# Altium schematic sheet B502DA.SchDoc: Air Temperature and Humidity Sensor
size A4; SheetNumber: 1; SheetTotal: 1
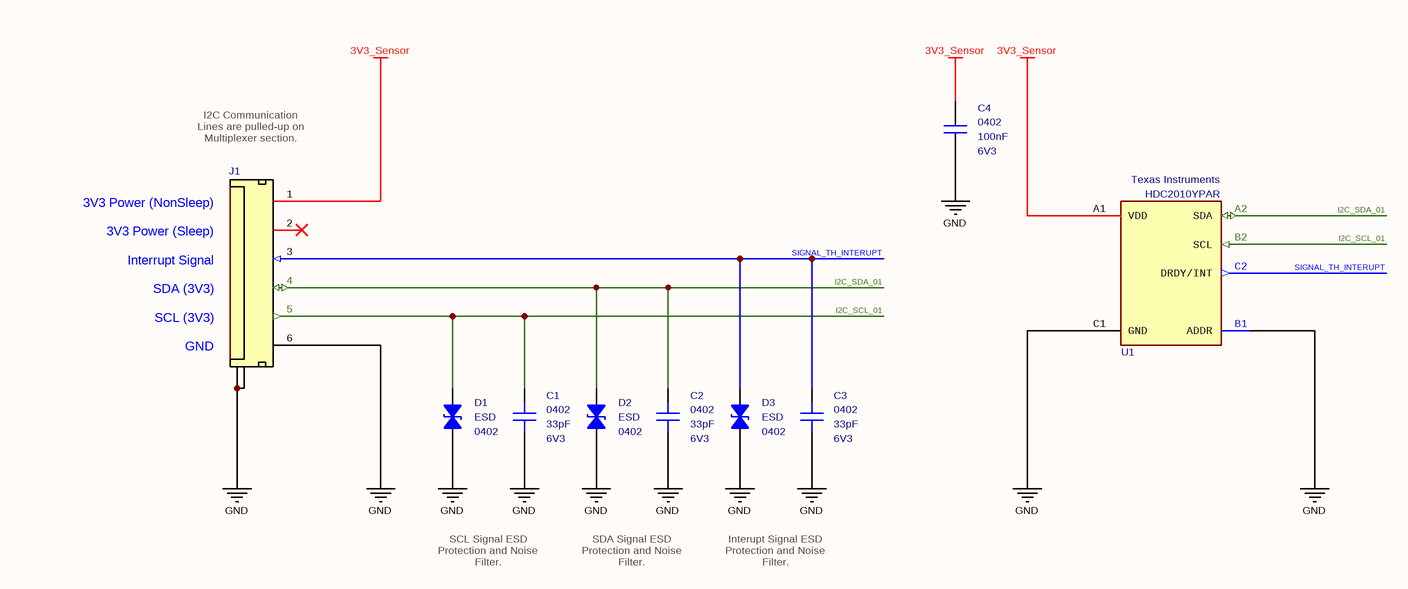
[diagram p0: B502DA.SchDoc]

## Parts
C1  value 33pF  Case: 0402  Voltage: 6V3  [CAPACITOR_0402]  (hidden comment: Multilayer Ceramic Capacitor)
C2  value 33pF  Case: 0402  Voltage: 6V3  [CAPACITOR_0402]  (hidden comment: Multilayer Ceramic Capacitor)
C3  value 33pF  Case: 0402  Voltage: 6V3  [CAPACITOR_0402]  (hidden comment: Multilayer Ceramic Capacitor)
C4  value 100nF  Case: 0402  Voltage: 6V3  [CAPACITOR_0402]  (hidden comment: Multilayer Ceramic Capacitor)
D1  Case: 0402  [ESD_0402]  (hidden comment: ESD Suppressors)
D2  Case: 0402  [ESD_0402]  (hidden comment: ESD Suppressors)
D3  Case: 0402  [ESD_0402]  (hidden comment: ESD Suppressors)
J1  T/H Sensor Socket  [Connector_Tunic 6P - H]  (value not drawn)
U1  Manufacturer_Part_Number: HDC2010YPAR  Manufacturer_Name: Texas Instruments  [HDC2010]  (hidden comment: Humidity and temperature digital sensor)

## Nets
3V3_Sensor: C4.1 J1.1(3V3_Sensor) U1.A1(VDD)
GND: C1.1 C2.1 C3.1 C4.2 D1.1 D2.1 D3.1 J1.6(GND) J1.7(Termination) J1.8(Termination) U1.B1(ADDR) U1.C1(GND)
I2C_SCL_01: C1.2 D1.2 J1.5(I2C_SCL_01) U1.B2(SCL)
I2C_SDA_01: C2.2 D2.2 J1.4(I2C_SDA_01) U1.A2(SDA)
SIGNAL_TH_INTERUPT: C3.2 D3.2 J1.3(SIGNAL_TH_INTERUPT) U1.C2(DRDY/INT)

Not connected (* = marked no-connect by the designer): J1 2(3V3_Digital)*

## Notes on the sheet
- I2C Communication Lines are pulled-up on Multiplexer section.
- (near J1) 3V3 Power (NonSleep)
  3V3 Power (Sleep)
  Interrupt Signal
  SDA (3V3)
  SCL (3V3)
  GND
- SCL Signal ESD Protection and Noise Filter.
- SDA Signal ESD Protection and Noise Filter.
- Interupt Signal ESD Protection and Noise Filter.
- Title
- Size:
- Date:
- A4
- Number:
- Time:
- Revision:
- Sheet
- of
- File:
- (in symbol Diode - ESD Protection) ESD

## Library data of the parts
C1-C3 = Capacitor - 33pF [0402-6V3]: Capacitor - 33pF [0402] (Ceramic); Manufacturer_Name: Kemet; Manufacturer_Part_Number: C0402C330J9RACAUTO; Dielectric: X7R; Tolerance: 10%; Height: 0.5mm; Mouser_Part_Number: 80-C0402C330J9RAUTO; Maximum Operating Temperature: +125; Minimum Operating Temperature: -55; ROHS: Yes; ComponentLink1Description: DataSheet; ComponentLink1URL: https://api.kemet.com/component-edge/download/datasheet/C0402C330J9RACAUTO.pdf; ComponentLink2Description: Mouser; ComponentLink2URL: https://www.mouser.com/Search/Refine.aspx?Keyword=80-C0402C330J9RAUTO; Supplier 1: Mouser; Supplier Part Number 1: 80-C0402C330J9RAUTO
C4 = Capacitor - 100nF [0402-6V3]: Capacitor - 100nF [0402-6V3] (Ceramic); Manufacturer_Name: AVX; Manufacturer_Part_Number: 04026D104KAT4A; Dielectric: X5R; Tolerance: %10; Height: 0.25mm; Mouser_Part_Number: 581-04026D104KAT4A; ComponentLink1Description: Mouser; ComponentLink1URL: https://www.mouser.com.tr/ProductDetail/AVX/04026D104KAT4A?qs=sGAEpiMZZMs0AnBnWHyRQPg4iYkCw7IMED%2F4kpqgf7w%3D; ComponentLink2Description: DataSheet; ComponentLink2URL: https://www.mouser.com.tr/datasheet/2/40/cx5r-776519.pdf; ROHS: Yes; Maximum Operating Temperature: +85; Minimum Operating Temperature: -55; Supplier 1: Avnet; Supplier Part Number 1: 04026D104KAT4A
D1-D3 = Diode - ESD Protection: TVS Diode (Bi-directional); Manufacturer_Name: Bussmann / Eaton; Manufacturer_Part_Number: 0402ESDA-MLP1; Clamping Voltage: 35V; Diode Capacitance: 0.05pF; Polarity: Bidirectional; Voltage ESD Air Gap: 15kV; Voltage ESD Contact: 8kV; Working Voltage: 30V; Height: 0.436mm; Mouser_Part_Number: 504-0402ESDA-MLP1; Maximum Operating Temperature: +125; Minimum Operating Temperature: -55; ROHS: Yes; ComponentLink1Description: DataSheet; ComponentLink1URL: https://www.mouser.com.tr/datasheet/2/87/47c59e11-d058-4882-bc35-d8572f2ca054-38826.pdf; ComponentLink2Description: Mouser; ComponentLink2URL: https://www.mouser.com.tr/ProductDetail/Bussmann-Eaton/0402ESDA-MLP1?qs=%2Fha2pyFadughxyc7TyLWeW%2FUvipVY6Ex3naV%2FjpO3plZBZWDLqV4bw%3D%3D; Supplier 1: Mouser; Supplier 2: Digi-Key; Supplier Part Number 2: 283-2964-1-ND; Supplier Part Number 1: 504-0402ESDA-MLP1
J1 = Connector - Mini Tunic 6P (1.25): Mini Tunic Connector with 6P; Manufacturer_Name: Molex; Manufacturer_Part_Number: 53261-0671; ROHS: Yes; Supplier 1: Avnet; Supplier 2: Mouser; Supplier 3: Arrow; Supplier 4: Farnell; Supplier 5: Newark; Supplier 6: Digi-Key; Supplier Part Number 1: 0532610671; Supplier Part Number 2: 538-53261-0671; Supplier Part Number 3: 53261-0671; Supplier Part Number 4: 1125375; Supplier Part Number 5: 93K4246; Supplier Part Number 6: WM7624CT-ND; System: Connector
U1 = IC - HDC2010YPAR: Mouser_Part_Number: 595-HDC2010YPAR; Case: DSBGA-6; RoHS: Yes; ComponentLink1Description: DataSheet; ComponentLink1URL: https://www.ti.com/lit/ds/symlink/hdc2010.pdf?ts=1594167980948&ref_url=https%253A%252F%252Fwww.google.com%252F; ComponentLink2Description: Mouser; ComponentLink2URL: https://www.mouser.com.tr/ProductDetail/Texas-Instruments/HDC2010YPAR?qs=EU6FO9ffTwc2CasHMLP4bA%3D%3D; Supplier 1: Arrow; Supplier 2: Avnet; Supplier 3: Mouser; Supplier 4: Digi-Key; Supplier 5: Digi-Key; Supplier 6: Digi-Key; Supplier Part Number 1: HDC2010YPAR; Supplier Part Number 2: HDC2010YPAR; Supplier Part Number 3: 595-HDC2010YPAR; Supplier Part Number 4: 296-47774-1-ND; Supplier Part Number 5: 296-47774-6-ND; Supplier Part Number 6: 296-47774-2-ND